# EAGLE design botstep23-5axis-carrier (EAGLE 5.11)
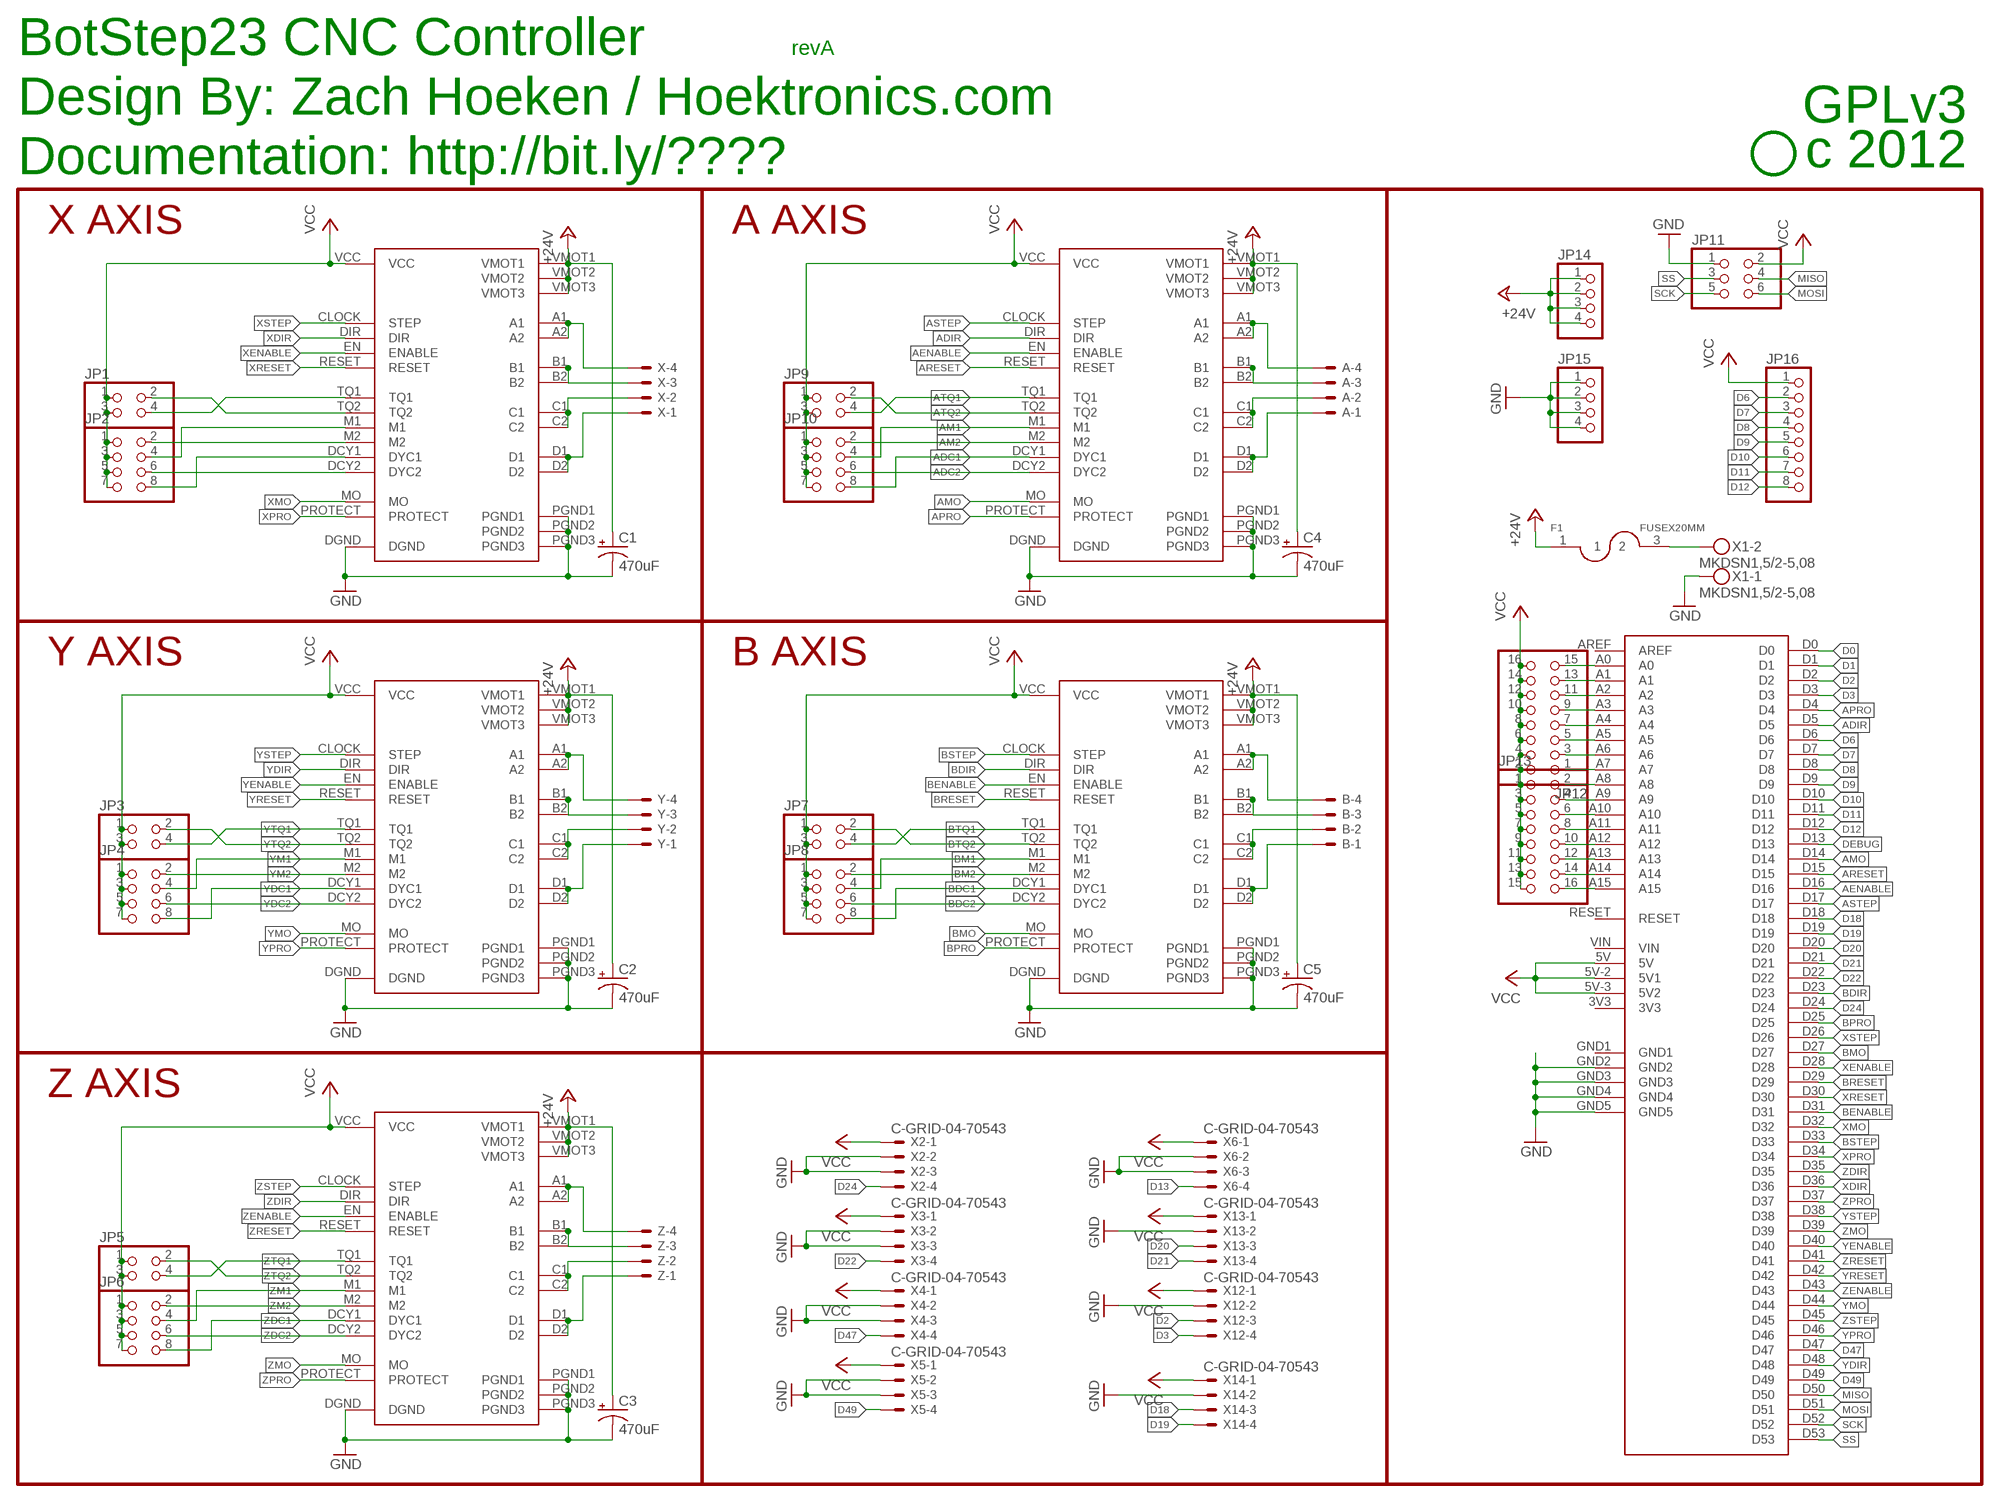
[diagram p0: schematic, sheet 1]

## Parts
A  KK-156-4  [KK-156-4]
B  KK-156-4  [KK-156-4]
C1  470uF  CPOL-USE3.5-8  [E3,5-8]
C2  470uF  CPOL-USE3.5-8  [E3,5-8]
C3  470uF  CPOL-USE3.5-8  [E3,5-8]
C4  470uF  CPOL-USE3.5-8  [E3,5-8]
C5  470uF  CPOL-USE3.5-8  [E3,5-8]
F1  FUSEX20MM  [FUSE_5MM]
JP1  PINHD-2X2  [2X02]
JP2  PINHD-2X4  [2X04]
JP3  PINHD-2X2  [2X02]
JP4  PINHD-2X4  [2X04]
JP5  PINHD-2X2  [2X02]
JP6  PINHD-2X4  [2X04]
JP7  PINHD-2X2  [2X02]
JP8  PINHD-2X4  [2X04]
JP9  PINHD-2X2  [2X02]
JP10  PINHD-2X4  [2X04]
JP11  PINHD-2X3  [2X03]
JP12  PINHD-2X8  [2X08]
JP13  PINHD-2X8  [2X08]
JP14  PINHD-1X4  [1X04]
JP15  PINHD-1X4  [1X04]
JP16  PINHD-1X8  [1X08]
U$1  BOTSTEP23  [BOTSTEP23]
U$2  BOTSTEP23  [BOTSTEP23]
U$3  BOTSTEP23  [BOTSTEP23]
U$4  BOTSTEP23  [BOTSTEP23]
U$5  BOTSTEP23  [BOTSTEP23]
U$6  ARDUINO-MEGA  [ARDUINO-MEGA]
X  KK-156-4  [KK-156-4]
X1  MKDSN1,5/2-5,08  [MKDSN1,5/2-5,08]
X2  C-GRID-04-70543  [70543-04]
X3  C-GRID-04-70543  [70543-04]
X4  C-GRID-04-70543  [70543-04]
X5  C-GRID-04-70543  [70543-04]
X6  C-GRID-04-70543  [70543-04]
X12  C-GRID-04-70543  [70543-04]
X13  C-GRID-04-70543  [70543-04]
X14  C-GRID-04-70543  [70543-04]
Y  KK-156-4  [KK-156-4]
Z  KK-156-4  [KK-156-4]

## Nets
+24V [power]: C1.+ C2.+ C3.+ C4.+ C5.+ F1.1 JP14.1 JP14.2 JP14.3 JP14.4 U$1.VMOT1 U$1.VMOT2 U$1.VMOT3 U$2.VMOT1 U$2.VMOT2 U$2.VMOT3 U$3.VMOT1 U$3.VMOT2 U$3.VMOT3 U$4.VMOT1 U$4.VMOT2 U$4.VMOT3 U$5.VMOT1 U$5.VMOT2 U$5.VMOT3
ADC1 [power]: JP10.8 U$4.DCY1(DYC1)
ADC2 [power]: JP10.6 U$4.DCY2(DYC2)
ADIR: U$4.DIR U$6.D5
AENABLE: U$4.EN(ENABLE) U$6.D16
AM1 [power]: JP10.4 U$4.M1
AM2 [power]: JP10.2 U$4.M2
AMO: U$4.MO U$6.D14
APRO: U$4.PROTECT U$6.D4
ARESET: U$4.RESET U$6.D15
ASTEP: U$4.CLOCK(STEP) U$6.D17
ATQ1 [power]: JP9.4 U$4.TQ1
ATQ2 [power]: JP9.2 U$4.TQ2
BDC1 [power]: JP8.8 U$5.DCY1(DYC1)
BDC2 [power]: JP8.6 U$5.DCY2(DYC2)
BDIR: U$5.DIR U$6.D23
BENABLE: U$5.EN(ENABLE) U$6.D31
BM1 [power]: JP8.4 U$5.M1
BM2 [power]: JP8.2 U$5.M2
BMO: U$5.MO U$6.D27
BPRO: U$5.PROTECT U$6.D25
BRESET: U$5.RESET U$6.D29
BSTEP: U$5.CLOCK(STEP) U$6.D33
BTQ1 [power]: JP7.4 U$5.TQ1
BTQ2 [power]: JP7.2 U$5.TQ2
D0: U$6.D0
D1: U$6.D1
D2: U$6.D2 X12.3
D3: U$6.D3 X12.4
D6: JP16.2 U$6.D6
D7: JP16.3 U$6.D7
D8: JP16.4 U$6.D8
D9: JP16.5 U$6.D9
D10: JP16.6 U$6.D10
D11: JP16.7 U$6.D11
D12: JP16.8 U$6.D12
D13: X6.4
D18: U$6.D18 X14.3
D19: U$6.D19 X14.4
D20: U$6.D20 X13.3
D21: U$6.D21 X13.4
D22: U$6.D22 X3.4
D24: U$6.D24 X2.4
D47: U$6.D47 X4.4
D49: U$6.D49 X5.4
DEBUG: U$6.D13
GND: C1.- C2.- C3.- C4.- C5.- JP11.1 JP15.1 JP15.2 JP15.3 JP15.4 U$1.DGND U$1.PGND1 U$1.PGND2 U$1.PGND3 U$2.DGND U$2.PGND1 U$2.PGND2 U$2.PGND3 U$3.DGND U$3.PGND1 U$3.PGND2 U$3.PGND3 U$4.DGND U$4.PGND1 U$4.PGND2 U$4.PGND3 U$5.DGND U$5.PGND1 U$5.PGND2 U$5.PGND3 U$6.GND2 U$6.GND3 U$6.GND4 U$6.GND5 X1.1 X2.2 X2.3 X3.2 X3.3 X4.2 X4.3 X5.2 X5.3 X6.2 X6.3 X12.2 X13.2 X14.2
MISO: JP11.4 U$6.D50
MOSI: JP11.6 U$6.D51
N$1 [power]: U$2.C1 U$2.C2 Y.2
N$2 [power]: U$1.C1 U$1.C2 X.2
N$3 [power]: U$1.B1 U$1.B2 X.3
N$4 [power]: U$1.A1 U$1.A2 X.4
N$5 [power]: U$1.D1 U$1.D2 X.1
N$6: F1.3 X1.2
N$7: JP12.15 U$6.A0
N$8: JP12.13 U$6.A1
N$9 [power]: U$2.B1 U$2.B2 Y.3
N$10 [power]: U$2.A1 U$2.A2 Y.4
N$11 [power]: U$2.D1 U$2.D2 Y.1
N$12: JP12.11 U$6.A2
N$13: JP12.9 U$6.A3
N$14: JP12.7 U$6.A4
N$15: JP12.5 U$6.A5
N$16: JP12.3 U$6.A6
N$17: JP12.1 U$6.A7
N$18: JP13.2 U$6.A8
N$19: JP13.4 U$6.A9
N$20: JP13.6 U$6.A10
N$21 [power]: U$3.C1 U$3.C2 Z.2
N$22 [power]: U$3.B1 U$3.B2 Z.3
N$23 [power]: U$3.A1 U$3.A2 Z.4
N$24 [power]: U$3.D1 U$3.D2 Z.1
N$25: JP13.8 U$6.A11
N$26: JP13.10 U$6.A12
N$27: JP13.12 U$6.A13
N$28: JP13.14 U$6.A14
N$29: JP13.16 U$6.A15
N$31 [power]: A.2 U$4.C1 U$4.C2
N$32 [power]: A.3 U$4.B1 U$4.B2
N$33 [power]: A.4 U$4.A1 U$4.A2
N$34 [power]: A.1 U$4.D1 U$4.D2
N$41 [power]: B.2 U$5.C1 U$5.C2
N$42 [power]: B.3 U$5.B1 U$5.B2
N$43 [power]: B.4 U$5.A1 U$5.A2
N$44 [power]: B.1 U$5.D1 U$5.D2
SCK: JP11.5 U$6.D52
SS: JP11.3 U$6.D53
VCC: JP1.1 JP1.3 JP2.1 JP2.3 JP2.5 JP2.7 JP3.1 JP3.3 JP4.1 JP4.3 JP4.5 JP4.7 JP5.1 JP5.3 JP6.1 JP6.3 JP6.5 JP6.7 JP7.1 JP7.3 JP8.1 JP8.3 JP8.5 JP8.7 JP9.1 JP9.3 JP10.1 JP10.3 JP10.5 JP10.7 JP11.2 JP12.2 JP12.4 JP12.6 JP12.8 JP12.10 JP12.12 JP12.14 JP12.16 JP13.1 JP13.3 JP13.5 JP13.7 JP13.9 JP13.11 JP13.13 JP13.15 JP16.1 U$1.VCC U$2.VCC U$3.VCC U$4.VCC U$5.VCC U$6.5V U$6.5V-2(5V1) U$6.5V-3(5V2) X2.1 X3.1 X4.1 X5.1 X6.1 X12.1 X13.1 X14.1
XDC1 [power]: JP2.8 U$1.DCY1(DYC1)
XDC2 [power]: JP2.6 U$1.DCY2(DYC2)
XDIR: U$1.DIR U$6.D36
XENABLE: U$1.EN(ENABLE) U$6.D28
XM1 [power]: JP2.4 U$1.M1
XM2 [power]: JP2.2 U$1.M2
XMO: U$1.MO U$6.D32
XPRO: U$1.PROTECT U$6.D34
XRESET: U$1.RESET U$6.D30
XSTEP: U$1.CLOCK(STEP) U$6.D26
XTQ1 [power]: JP1.4 U$1.TQ1
XTQ2 [power]: JP1.2 U$1.TQ2
YDC1 [power]: JP4.8 U$2.DCY1(DYC1)
YDC2 [power]: JP4.6 U$2.DCY2(DYC2)
YDIR: U$2.DIR U$6.D48
YENABLE: U$2.EN(ENABLE) U$6.D40
YM1 [power]: JP4.4 U$2.M1
YM2 [power]: JP4.2 U$2.M2
YMO: U$2.MO U$6.D44
YPRO: U$2.PROTECT U$6.D46
YRESET: U$2.RESET U$6.D42
YSTEP: U$2.CLOCK(STEP) U$6.D38
YTQ1 [power]: JP3.4 U$2.TQ1
YTQ2 [power]: JP3.2 U$2.TQ2
ZDC1 [power]: JP6.8 U$3.DCY1(DYC1)
ZDC2 [power]: JP6.6 U$3.DCY2(DYC2)
ZDIR: U$3.DIR U$6.D35
ZENABLE: U$3.EN(ENABLE) U$6.D43
ZM1 [power]: JP6.4 U$3.M1
ZM2 [power]: JP6.2 U$3.M2
ZMO: U$3.MO U$6.D39
ZPRO: U$3.PROTECT U$6.D37
ZRESET: U$3.RESET U$6.D41
ZSTEP: U$3.CLOCK(STEP) U$6.D45
ZTQ1 [power]: JP5.4 U$3.TQ1
ZTQ2 [power]: JP5.2 U$3.TQ2
Unconnected: U$6.3V3 U$6.AREF U$6.GND1 U$6.RESET U$6.VIN

## Notes on the sheet
- BotStep23 CNC Controller | revA
- GPLv3
- Design By: Zach Hoeken / Hoektronics.com | c 2012
- Documentation: http://bit.ly/????
- X AXIS | A AXIS
- Y AXIS | B AXIS
- Z AXIS

## Library data of the parts
A B X Y Z = con-molex:KK-156-4: KK 156 HEADER Source: http://www.molex.com/pdm_docs/sd/026604100_sd.pdf
C1-C5 = rcl:CPOL-US: POLARIZED CAPACITOR, American symbol
F1 = SparkFun:FUSE
JP1 JP3 JP5 JP7 JP9 = pinhead:PINHD-2X2: PIN HEADER
JP2 JP4 JP6 JP8 JP10 = pinhead:PINHD-2X4: PIN HEADER
JP11 = pinhead:PINHD-2X3: PIN HEADER
JP12 JP13 = pinhead:PINHD-2X8: PIN HEADER
JP14 JP15 = pinhead:PINHD-1X4: PIN HEADER
JP16 = pinhead:PINHD-1X8: PIN HEADER
U$1-U$5 = Hoeken:BOTSTEP23
U$6 = MakerBot:ARDUINO-MEGA
X1 = con-phoenix-508:MKDSN1,5/2-5,08: MKDSN 1,5/ 2-5,08 Printklemme Nennstrom: 13,5 A Nennspannung: 250 V Rastermaß: 5,08 mm Polzahl: 2 Anschlussart: Schraubanschluss Montage: Löten Anschlussrichtung Leiter/Platine: 0 ° Artikelnummer: 1729128 Source: http://eshop.phoenixcontact.com .. 1729128.pdf
X2-X6 X12-X14 = con-molex:C-GRID-04: CONNECTOR wire to board 2.54 mm (0.100") pitch header

## Net classes
0 default: width 0.406 mm, clearance 0.381 mm
1 power: width 1.27 mm, clearance 0.635 mm

## Board
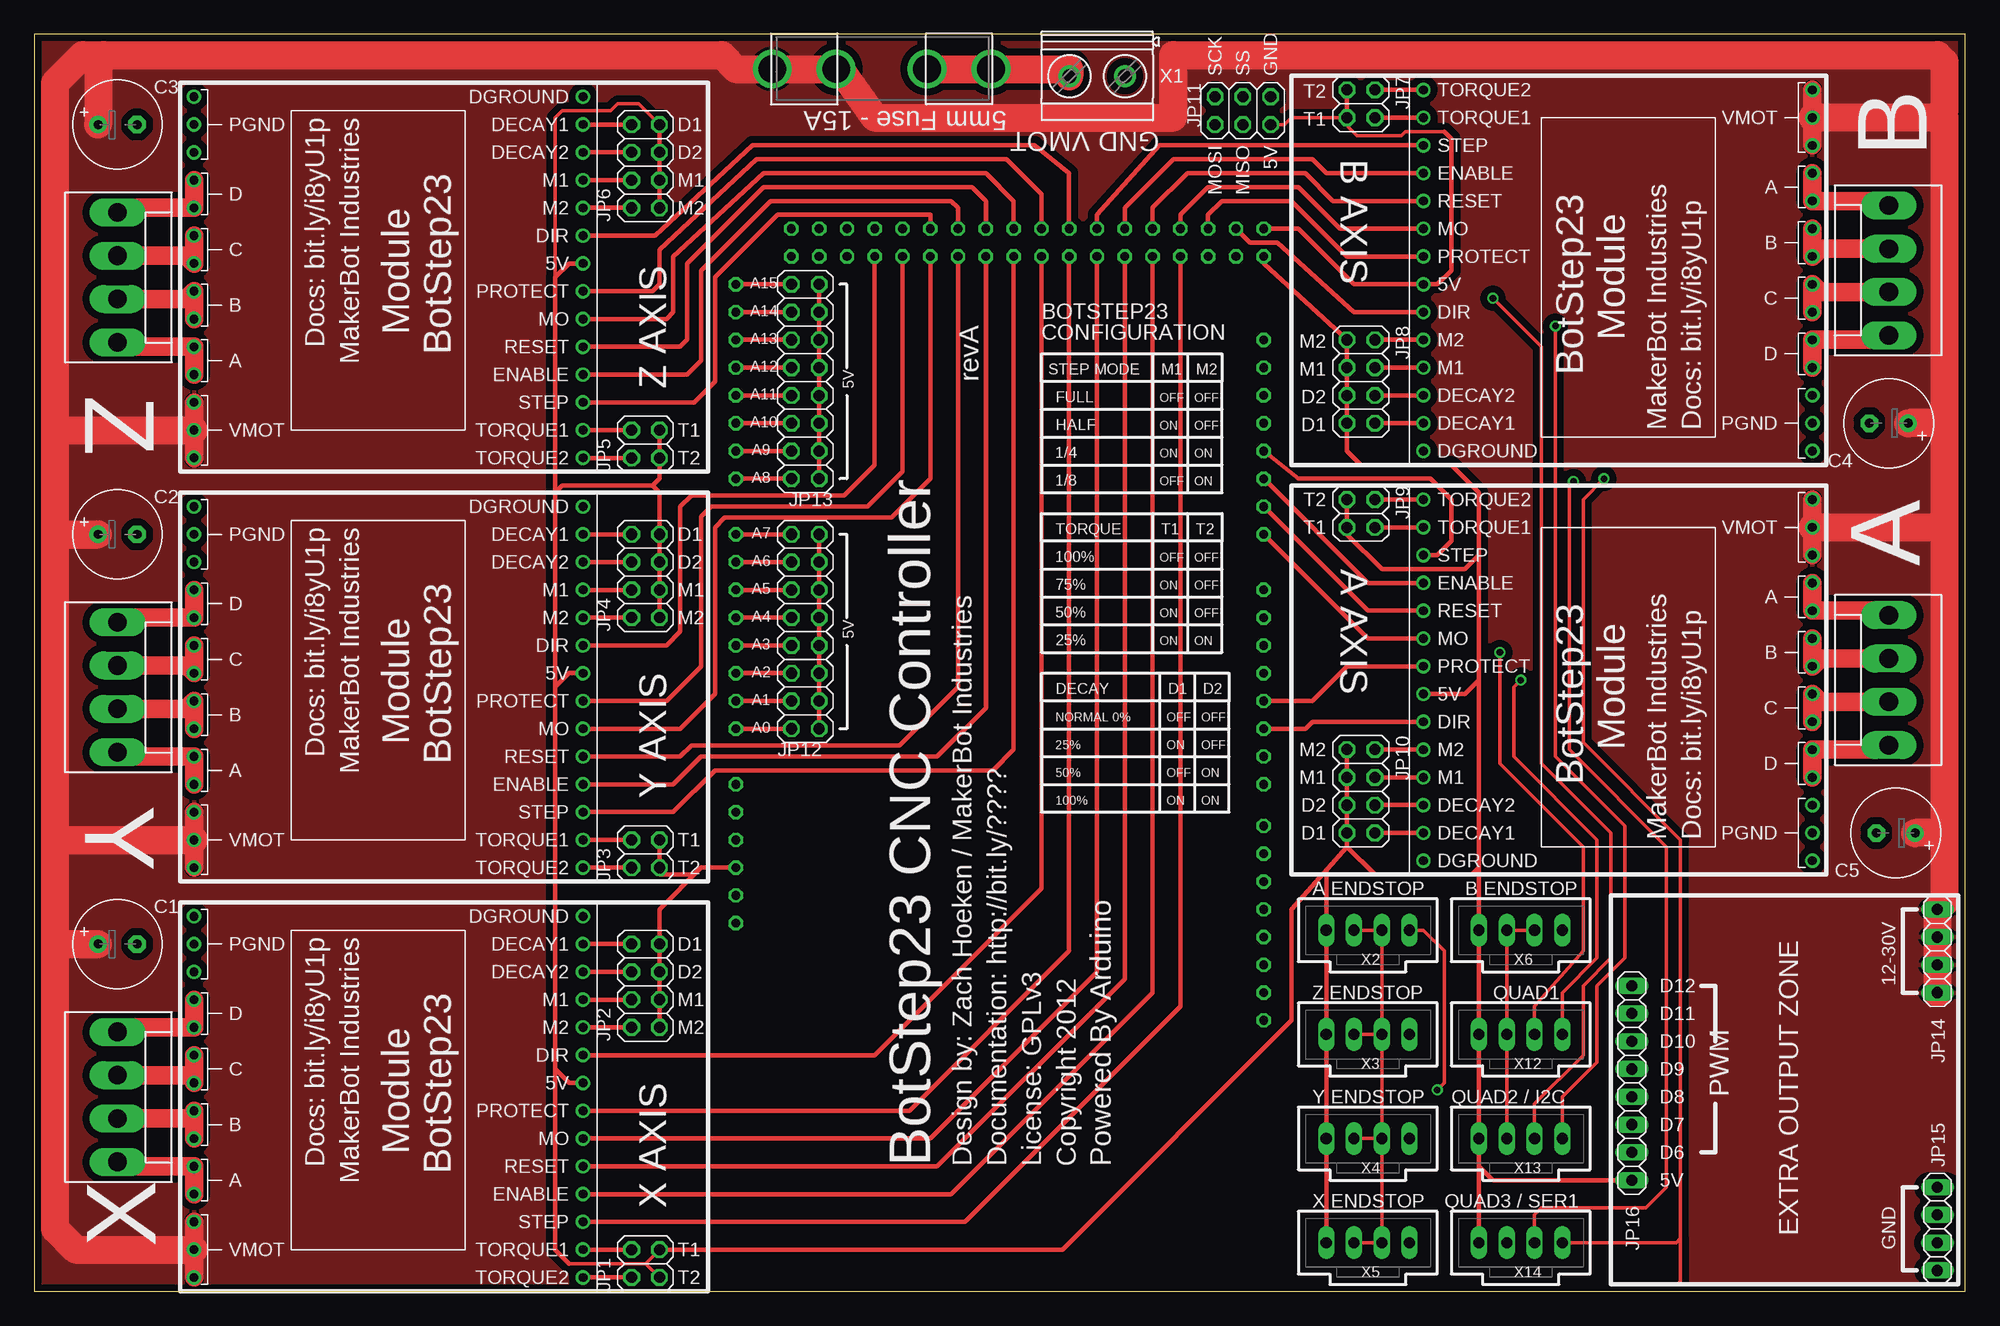
[diagram p1: board, top side]
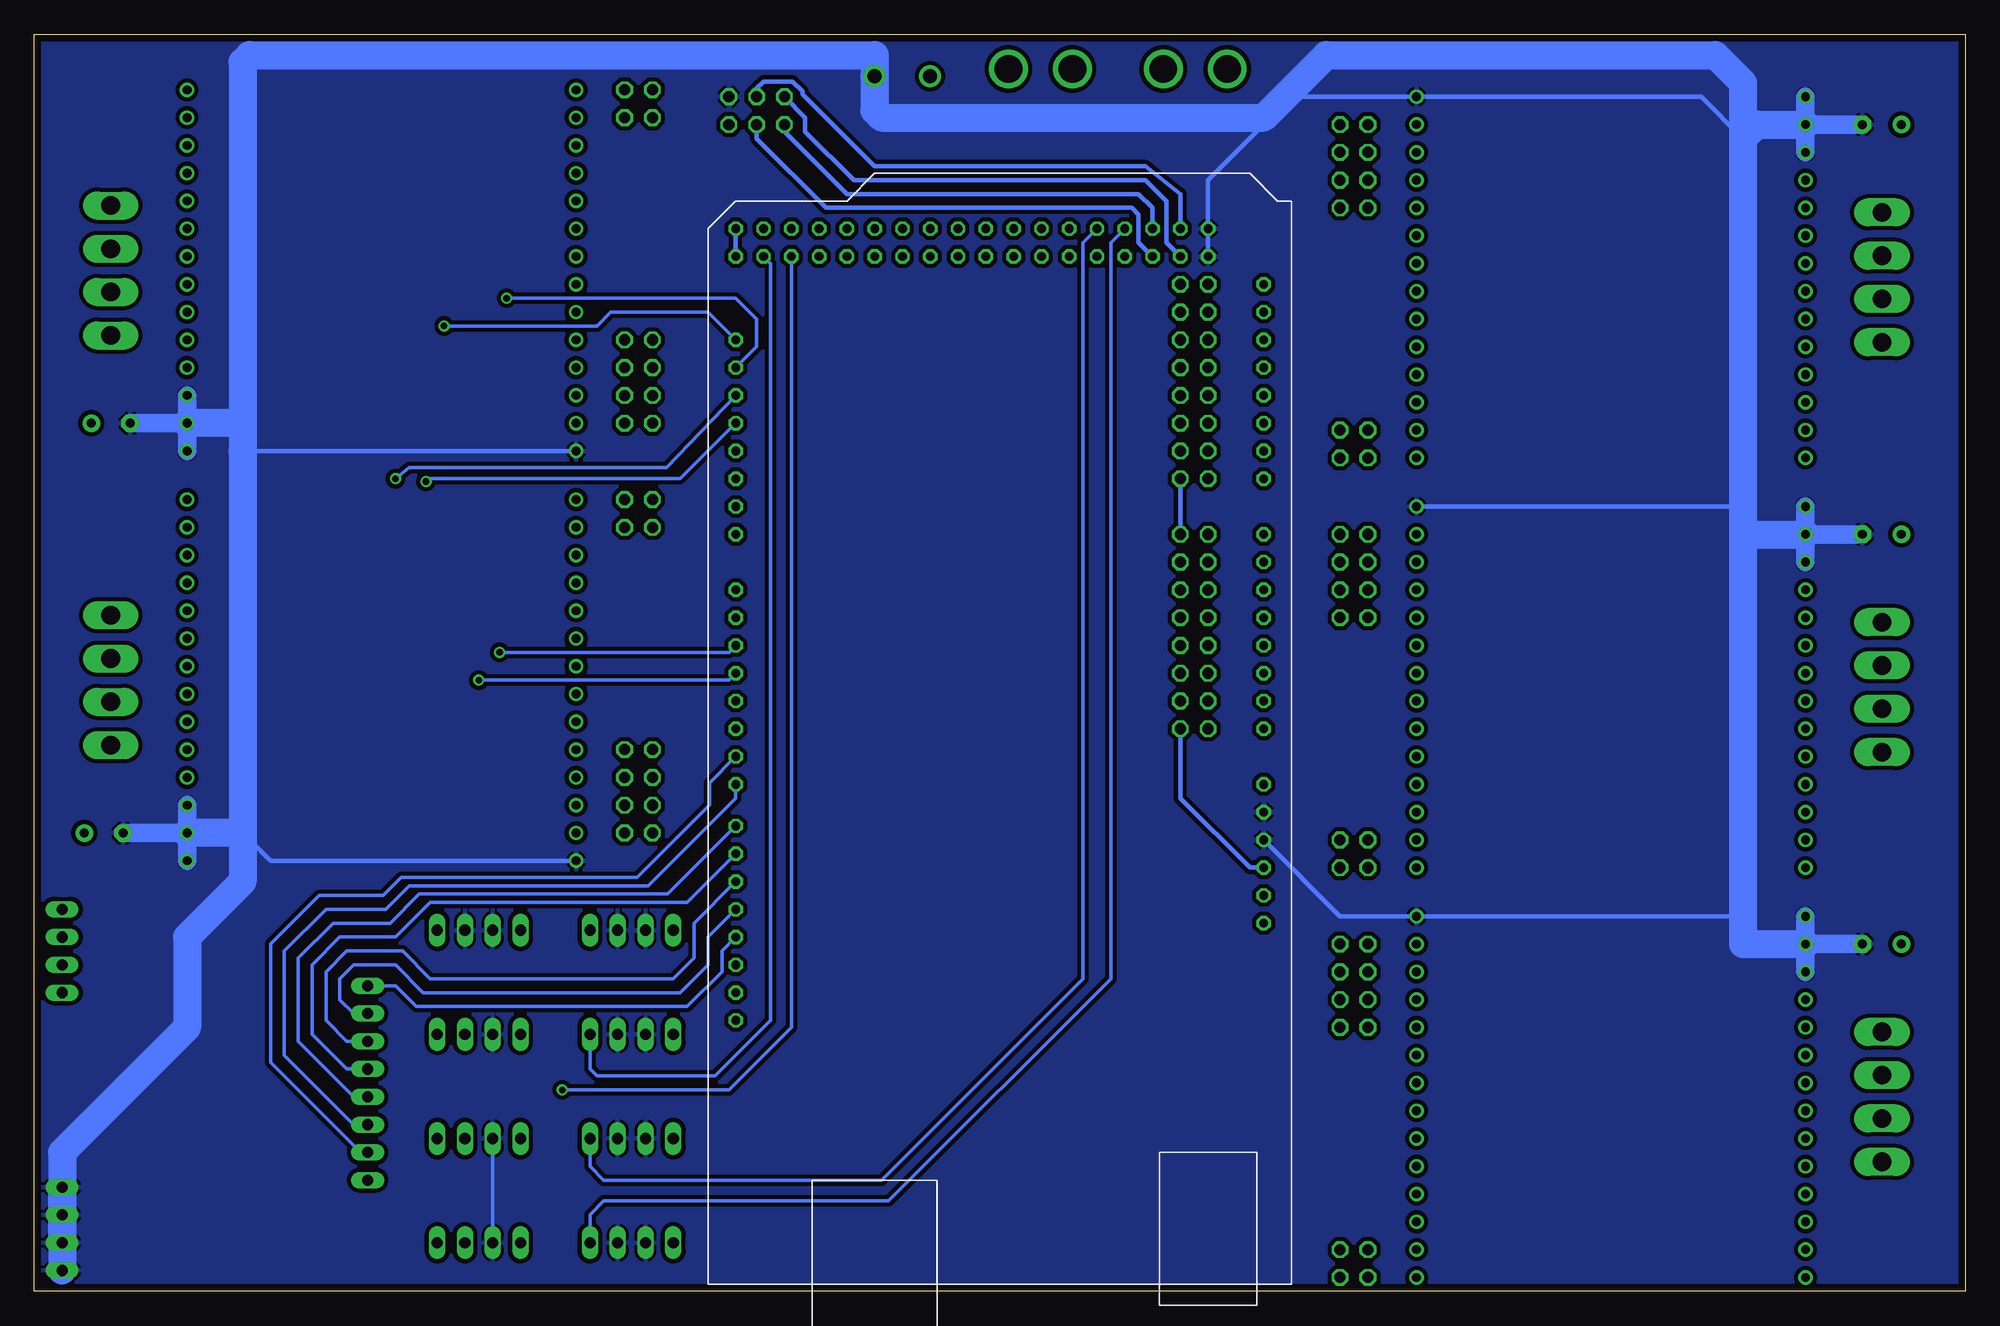
[diagram p2: board, bottom side, seen from below]

Size 176.53 x 114.94 mm. Coordinates in mm from the lower left corner, seen from the top.
Outline: 176.53,0 176.53,114.94 0,114.94 0,0 176.53,0
Copper layers (1*16): Top 0.035mm / dielectric 1.5mm / Bottom 0.035mm
Design rules "default *": minimum track width 10mil, minimum drill 24mil, track to track 15mil, track to pad 15mil, pad to pad 15mil, via to via 15mil, smd to smd 15mil, copper to edge 25mil, drill to drill 15mil, minimum pad ring 10mil, minimum via ring 8mil, stop-mask expansion 4mil, vias tented up to drill 0mil, thermal gap 10mil

### Footprints (pad centres in the part's own frame; a part is rotated, then mirrored left to right if it is on the bottom)
KK-156-4 = drill 1.7 pad 2.184 long: 1 -5.94,0; 2 -1.98,0; 3 1.98,0; 4 5.94,0
E3,5-8 = drill 0.813 pad 1.6 round: + -1.778,0 | drill 0.813 pad 1.6 octagon: - 1.778,0
FUSE_5MM = drill 2.54 pad 3.556 round: 1 0,-10; 2 0,-4.158; 3 0,4.158; 4 0,10
2X02 = drill 1.016 octagon: 1 -1.27,-1.27; 2 -1.27,1.27; 3 1.27,-1.27; 4 1.27,1.27
2X04 = drill 1.016 octagon: 1 -3.81,-1.27; 2 -3.81,1.27; 3 -1.27,-1.27; 4 -1.27,1.27; 5 1.27,-1.27; 6 1.27,1.27; 7 3.81,-1.27; 8 3.81,1.27
2X03 = drill 1.016 octagon: 1 -2.54,-1.27; 2 -2.54,1.27; 3 0,-1.27; 4 0,1.27; 5 2.54,-1.27; 6 2.54,1.27
2X08 = drill 1.016 octagon: 1 -8.89,-1.27; 2 -8.89,1.27; 3 -6.35,-1.27; 4 -6.35,1.27; 5 -3.81,-1.27; 6 -3.81,1.27; 7 -1.27,-1.27; 8 -1.27,1.27; 9 1.27,-1.27; 10 1.27,1.27; 11 3.81,-1.27; 12 3.81,1.27; 13 6.35,-1.27; 14 6.35,1.27; 15 8.89,-1.27; 16 8.89,1.27
1X04 = drill 1.016 long: 1 -3.81,0; 2 -1.27,0; 3 1.27,0; 4 3.81,0
1X08 = drill 1.016 long: 1 -8.89,0; 2 -6.35,0; 3 -3.81,0; 4 -1.27,0; 5 1.27,0; 6 3.81,0; 7 6.35,0; 8 8.89,0
BOTSTEP23 = drill 0.8 round: A1 17.78,7.62; A2 17.78,5.08; B1 17.78,2.54; B2 17.78,0; C1 17.78,-2.54; C2 17.78,-5.08; CLOCK -17.78,10.16; D1 17.78,-7.62; D2 17.78,-10.16; DCY1 -17.78,-15.24; DCY2 -17.78,-12.7; DGND -17.78,-17.78; DIR -17.78,-5.08; EN -17.78,7.62; M1 -17.78,-10.16; M2 -17.78,-7.62; MO -17.78,2.54; PGND1 17.78,-12.7; PGND2 17.78,-15.24; PGND3 17.78,-17.78; PROTECT -17.78,0; RESET -17.78,5.08; TQ1 -17.78,12.7; TQ2 -17.78,15.24; VCC -17.78,-2.54; VMOT1 17.78,15.24; VMOT2 17.78,12.7; VMOT3 17.78,10.16
ARDUINO-MEGA = drill 0.8 octagon: 3V3 35.56,2.54; 5V 93.98,50.8; 5V-2 96.52,50.8; 5V-3 38.1,2.54; A0 50.8,2.54; A1 53.34,2.54; A2 55.88,2.54; A3 58.42,2.54; A4 60.96,2.54; A5 63.5,2.54; A6 66.04,2.54; A7 68.58,2.54; A8 73.66,2.54; A9 76.2,2.54; A10 78.74,2.54; A11 81.28,2.54; A12 83.82,2.54; A13 86.36,2.54; A14 88.9,2.54; A15 91.44,2.54; AREF 24.13,50.8; D0 63.5,50.8; D1 60.96,50.8; D2 58.42,50.8; D3 55.88,50.8; D4 53.34,50.8; D5 50.8,50.8; D6 48.26,50.8; D7 45.72,50.8; D8 41.91,50.8; D9 39.37,50.8; D10 36.83,50.8; D11 34.29,50.8; D12 31.75,50.8; D13 29.21,50.8; D14 68.58,50.8; D15 71.12,50.8; D16 73.66,50.8; D17 76.2,50.8; D18 78.74,50.8; D19 81.28,50.8; D20 83.82,50.8; D21 86.36,50.8; D22 93.98,48.26; D23 96.52,48.26; D24 93.98,45.72; D25 96.52,45.72; D26 93.98,43.18; D27 96.52,43.18; D28 93.98,40.64; D29 96.52,40.64; D30 93.98,38.1; D31 96.52,38.1; D32 93.98,35.56; D33 96.52,35.56; D34 93.98,33.02; D35 96.52,33.02; D36 93.98,30.48; D37 96.52,30.48; D38 93.98,27.94; D39 96.52,27.94; D40 93.98,25.4; D41 96.52,25.4; D42 93.98,22.86; D43 96.52,22.86; D44 93.98,20.32; D45 96.52,20.32; D46 93.98,17.78; D47 96.52,17.78; D48 93.98,15.24; D49 96.52,15.24; D50 93.98,12.7; D51 96.52,12.7; D52 93.98,10.16; D53 96.52,10.16; GND1 26.67,50.8; GND2 93.98,7.62; GND3 96.52,7.62; GND4 40.64,2.54; GND5 43.18,2.54; RESET 33.02,2.54; VIN 45.72,2.54
MKDSN1,5/2-5,08 = drill 1.3 pad 2 round: 1 -2.561,0.025; 2 2.519,0.025
70543-04 = drill 1.016 long: 1 -3.81,0; 2 -1.27,0; 3 1.27,0; 4 3.81,0

### Placement (x,y rotation side)
A  169.54,55.88 90 top
B  169.54,93.34 90 top
C1  7.62,31.75 0 top
C2  7.62,69.22 0 top
C3  7.62,106.68 0 top
C4  169.54,79.38 180 top
C5  170.18,41.91 180 top
F1  77.47,111.76 270 top
JP1  55.88,2.54 90 top
JP2  55.88,27.94 90 top
JP3  55.88,40.01 90 top
JP4  55.88,65.41 90 top
JP5  55.88,77.47 90 top
JP6  55.88,102.87 90 top
JP7  121.28,108.58 270 top
JP8  121.28,83.19 270 top
JP9  121.28,71.12 270 top
JP10  121.28,45.72 270 top
JP11  110.49,107.95 180 top
JP12  70.48,60.33 270 top
JP13  70.48,83.19 90 top
JP14  173.99,31.11 90 top
JP15  173.99,5.71 90 top
JP16  146.05,19.05 90 top
U$1  32.38,16.51 180 top
U$2  32.38,53.98 180 top
U$3  32.38,91.44 180 top
U$4  144.78,57.15 0 top
U$5  144.78,94.61 0 top
U$6  61.59,0.64 90 bottom
X  7.62,17.78 270 top
X1  97.16,111.12 180 top
X2  121.92,33.02 0 top
X3  121.92,23.5 0 top
X4  121.92,13.97 0 top
X5  121.92,4.45 0 top
X6  135.89,33.02 0 top
X12  135.89,23.5 0 top
X13  135.89,13.97 0 top
X14  135.89,4.45 0 top
Y  7.62,55.24 270 top
Z  7.62,92.71 270 top

### Tracks (layer width: path | path; a pad name or v marks a point on that pad's centre or on a via)
+24V
  Top 1.676: U$2.VMOT3 U$2.VMOT2 U$2.VMOT1 | U$3.VMOT1 U$3.VMOT2 U$3.VMOT3 | U$5.VMOT1 U$5.VMOT2 U$5.VMOT3 | U$4.VMOT1 U$4.VMOT2 U$4.VMOT3 | U$1.VMOT3 U$1.VMOT2 U$1.VMOT1
  Top 2.54: 1.91,31.75 1.91,41.27 | 1.91,41.27 1.91,69.22 | 1.91,69.22 1.91,78.74 | 1.91,69.22 C2.+ | 1.91,31.75 C1.+ | 1.91,78.74 U$3.VMOT2 | 1.91,41.27 U$2.VMOT2 | 174.62,69.85 174.62,41.91 | 174.62,79.38 174.62,69.85 | 174.62,79.38 174.62,107.31 173.99,107.31 | 173.99,107.31 U$5.VMOT2 | 174.62,69.85 U$4.VMOT2 | 174.62,41.91 C5.+ | 174.62,79.38 C4.+ | 1.91,31.75 1.91,5.71 3.81,3.81 U$1.VMOT2 | 6.35,113.03 4.45,113.03 1.91,110.49 1.91,78.74 | C3.+ 5.84,112.52 6.35,113.03 | 173.99,107.31 174.62,107.95 174.62,112.39 173.99,113.03 104.14,113.03 104.14,107.31 76.83,107.31 73.66,111.76 F1.1 64.14,111.76 62.87,113.03 6.35,113.03 | 174.62,41.91 174.62,35.56 JP14.4 JP14.3 JP14.2 JP14.1
  pour Top: 0,114.94 176.53,114.94 176.53,0 0,0
ADC1
  Top 0.406: JP10.8 U$4.DCY1
ADC2
  Top 0.406: JP10.6 U$4.DCY2
ADIR
  Top 0.406: U$6.D5 116.2,51.44 116.84,52.07 U$4.DIR
AENABLE
  Top 0.406: U$4.EN 121.92,64.77 U$6.D16
AM1
  Top 0.406: JP10.4 U$4.M1
AM2
  Top 0.406: JP10.2 U$4.M2
AMO
  Top 0.406: U$4.MO 121.92,59.69 U$6.D14
APRO
  Top 0.406: U$4.PROTECT 120.02,57.15 116.84,53.98 U$6.D4
ARESET
  Top 0.406: U$4.RESET 121.92,62.23 U$6.D15
ASTEP
  Top 0.406: U$4.CLOCK 128.27,67.31 129.54,68.58 129.54,72.39 127.64,74.3 115.57,74.3 U$6.D17
ATQ1
  Top 0.406: JP9.4 U$4.TQ1
ATQ2
  Top 0.406: JP9.2 U$4.TQ2
BDC1
  Top 0.406: JP8.8 U$5.DCY1
BDC2
  Top 0.406: JP8.6 U$5.DCY2
BDIR
  Top 0.406: U$6.D23 111.12,95.89 113.67,95.89 120.65,89.53 U$5.DIR
BENABLE
  Top 0.406: U$5.EN 118.11,102.23 116.84,103.5 104.14,103.5 99.69,99.06 U$6.D31
BM1
  Top 0.406: JP8.4 U$5.M1
BM2
  Top 0.406: JP8.2 U$5.M2
BMO
  Top 0.406: U$5.MO 119.38,97.16 115.57,100.97 107.31,100.97 104.78,98.42 U$6.D27
BPRO
  Top 0.406: U$5.PROTECT 120.02,94.61 114.94,99.69 108.58,99.69 107.31,98.42 U$6.D25
BRESET
  Top 0.406: U$5.RESET 118.75,99.69 116.2,102.23 105.41,102.23 102.23,99.06 U$6.D29
BSTEP
  Top 0.406: U$5.CLOCK 102.87,104.78 97.16,98.42 U$6.D33
BTQ1
  Top 0.406: JP7.4 U$5.TQ1
BTQ2
  Top 0.406: JP7.2 U$5.TQ2
D2  (via drill 0.6)
  Top 0.305: v133.99,58.42 133.99,48.26 141.6,40.64 141.6,31.11 137.16,26.04 X12.3
  Bottom 0.305: U$6.D2 113.03,58.42 v133.99,58.42
D3  (via drill 0.6)
  Top 0.305: X12.4 139.7,27.3 142.88,30.48 142.88,41.27 135.25,48.9 135.25,55.24 v135.89,55.88
  Bottom 0.305: v135.89,55.88 113.03,55.88 U$6.D3
D6
  Bottom 0.305: JP16.2 146.69,12.7 154.94,20.95 154.94,31.75 150.5,36.2 144.65,36.2 143,37.85 121.41,37.85 114.81,44.45 114.81,46.48 U$6.D6
D7
  Bottom 0.305: JP16.3 147.32,15.24 153.67,21.59 153.67,31.11 149.86,34.92 144.4,34.92 142.24,37.08 120.4,37.08 112.39,45.09 U$6.D7
D8
  Bottom 0.305: JP16.4 147.32,17.78 152.4,22.86 152.4,30.48 149.22,33.66 144.02,33.66 141.35,36.32 118.62,36.32 U$6.D8
D9
  Bottom 0.305: JP16.5 147.96,20.32 151.13,23.5 151.13,29.84 148.59,32.38 143.51,32.38 140.34,35.56 116.84,35.56 U$6.D9
D10
  Bottom 0.305: JP16.6 147.96,22.86 149.86,24.77 149.86,29.21 147.96,31.11 142.88,31.11 140.34,28.57 118.11,28.57 116.2,30.48 116.2,33.66 U$6.D10
D11
  Bottom 0.305: JP16.7 147.32,25.4 148.59,26.67 148.59,28.57 147.32,29.84 143.51,29.84 140.97,27.3 117.47,27.3 114.94,29.84 114.94,32.38 U$6.D11
D12
  Bottom 0.305: JP16.8 143.51,27.94 141.6,26.04 116.84,26.04 113.67,29.21 113.67,31.11 U$6.D12
D18  (via drill 0.6)
  Top 0.305: X14.3 137.16,6.99 137.79,7.62 147.32,7.62 149.22,9.53 149.22,40.64 140.34,49.53 140.34,73.66 v140.72,74.04
  Bottom 0.305: U$6.D18 117.47,74.3 140.34,74.3 140.59,74.04 v140.72,74.04
D19  (via drill 0.6)
  Top 0.305: v143.51,74.3 141.6,72.39 141.6,50.16 150.5,41.27 150.5,4.83 | 150.5,4.83 150.5,0.89 150.37,0.76 | X14.4 150.11,4.45 150.5,4.83
  Bottom 0.305: v143.51,74.3 142.24,75.31 118.75,75.31 U$6.D19
D20  (via drill 0.6)
  Top 0.305: X13.3 137.16,17.14 141.6,21.59 141.6,27.94 144.15,30.48 144.15,41.91 137.79,48.26 137.79,86.36 v133.35,90.81
  Bottom 0.305: v133.35,90.81 112.39,90.81 110.49,88.9 110.49,86.36 U$6.D20
D21  (via drill 0.6)
  Top 0.305: X13.4 139.7,17.78 142.88,20.95 142.88,27.94 145.41,30.48 145.41,42.55 139.06,48.9 v139.06,88.27
  Bottom 0.305: v139.06,88.27 125.09,88.27 123.83,89.53 114.94,89.53 U$6.D21
D22
  Bottom 0.305: X3.4 125.73,20.32 125.09,19.68 114.3,19.68 109.22,24.77 109.22,93.98 U$6.D22
D24  (via drill 0.6)
  Top 0.305: X2.4 127,33.02 128.91,31.11 128.91,19.05 v128.27,18.41
  Bottom 0.305: v128.27,18.41 113.03,18.41 107.31,24.13 U$6.D24
D47
  Bottom 0.305: X4.4 125.73,11.43 124.46,10.16 99.06,10.16 80.64,28.57 80.64,95.89 U$6.D47
D49
  Bottom 0.305: X5.4 125.73,6.99 124.46,8.26 98.42,8.26 78.11,28.57 78.11,95.89 U$6.D49
GND
  Top 0.305: X13.2 X12.2 X6.2 X6.3 | X4.3 X5.3 X5.2 | X4.3 X3.3 | X3.3 X3.2 | X4.3 X4.2 | X3.3 X2.3 X2.2
  Bottom 0.305: X14.2 X13.2
  Bottom 0.406: 20.32,71.75 U$2.DGND | 20.32,105.41 24.13,109.22 U$3.DGND 61.59,109.22 69.22,101.6 U$6.GND3 U$6.GND2 | 20.32,34.29 U$1.DGND 57.15,34.29 U$6.GND4 | 157.48,76.83 U$5.DGND | U$4.DGND 154.94,39.37 157.48,41.91
  Bottom 1.676: U$1.PGND2 U$1.PGND1 | U$1.PGND2 C1.- | U$2.PGND2 C2.- | U$2.PGND2 U$2.PGND3 | U$3.PGND2 C3.- | U$3.PGND2 U$3.PGND3 | U$3.PGND2 U$3.PGND1 | C4.- U$5.PGND2 U$5.PGND1 | U$1.PGND2 U$1.PGND3 | U$2.PGND2 U$2.PGND1 | U$4.PGND2 U$4.PGND1 | U$4.PGND2 U$4.PGND3 | U$4.PGND2 C5.- | U$5.PGND3 162.56,78.74 161.93,79.38
  Bottom 2.54: 20.32,69.22 20.32,34.29 20.32,31.75 U$1.PGND2 | 20.32,69.22 20.32,71.75 20.32,105.41 | 20.32,105.41 19.05,106.68 U$3.PGND2 | 20.32,69.22 U$2.PGND2 | 157.48,79.38 157.48,76.83 157.48,41.91 | 157.48,41.91 U$4.PGND2 | 157.48,79.38 161.93,79.38 U$5.PGND2 | 157.48,79.38 157.48,112.39 156.84,113.03 99.69,113.03 99.69,111.12 99.72,111.12 X1.1 99.72,107.97 99.06,107.31 64.14,107.31 58.42,113.03 22.86,113.03 20.32,110.49 20.32,105.41 | JP15.2 JP15.1 | JP15.2 JP15.3 JP15.4 | JP15.2 173.99,12.7 162.56,24.13 162.56,32.38 157.48,37.47 157.48,41.91
  pour Bottom: 0,114.94 176.53,114.94 176.53,0 0,0
MISO
  Bottom 0.406: U$6.D50 75.56,95.89 75.56,98.42 76.2,99.06 104.14,99.06 110.49,105.41 JP11.4
MOSI
  Bottom 0.406: U$6.D51 74.3,99.06 75.56,100.33 102.23,100.33 107.95,106.05 JP11.6
N$1
  Top 1.676: U$2.C2 U$2.C1 13.89,57.23 Y.2
N$2
  Top 1.676: 14.61,19.68 U$1.C1 | 14.61,19.68 U$1.C2 | X.2 14.53,19.76 14.61,19.68
N$3
  Top 1.676: 14.61,15.88 U$1.B1 | 14.61,15.88 U$1.B2 | X.3 14.53,15.8 14.61,15.88
N$4
  Top 1.676: U$1.A1 U$1.A2 8.03,11.43 X.4
N$5
  Top 1.676: U$1.D2 U$1.D1 8.03,24.13 X.1
N$6
  Top 2.54: X1.2 94.64,111.74 94.61,111.76 F1.3
N$7
  Top 0.406: U$6.A0 JP12.15
N$8
  Top 0.406: U$6.A1 JP12.13
N$9
  Top 1.676: U$2.B1 U$2.B2 13.89,53.27 Y.3
N$10
  Top 1.676: U$2.A1 U$2.A2 8.03,48.9 Y.4
N$11
  Top 1.676: U$2.D2 U$2.D1 8.03,61.59 Y.1
N$12
  Top 0.406: U$6.A2 JP12.11
N$13
  Top 0.406: U$6.A3 JP12.9
N$14
  Top 0.406: U$6.A4 JP12.7
N$15
  Top 0.406: U$6.A5 JP12.5
N$16
  Top 0.406: U$6.A6 JP12.3
N$17
  Top 0.406: U$6.A7 JP12.1
N$18
  Top 0.406: U$6.A8 JP13.2
N$19
  Top 0.406: U$6.A9 JP13.4
N$20
  Top 0.406: U$6.A10 JP13.6
N$21
  Top 1.676: U$3.C2 U$3.C1 13.89,94.69 Z.2
N$22
  Top 1.676: U$3.B1 U$3.B2 13.89,90.73 Z.3
N$23
  Top 1.676: U$3.A1 U$3.A2 8.03,86.36 Z.4
N$24
  Top 1.676: U$3.D2 U$3.D1 8.03,99.06 Z.1
N$25
  Top 0.406: U$6.A11 JP13.8
N$26
  Top 0.406: U$6.A12 JP13.10
N$27
  Top 0.406: U$6.A13 JP13.12
N$28
  Top 0.406: U$6.A14 JP13.14
N$29
  Top 0.406: U$6.A15 JP13.16
N$31
  Top 1.676: U$4.C2 U$4.C1 163.27,53.9 A.2
N$32
  Top 1.676: U$4.B1 U$4.B2 163.27,57.86 A.3
N$33
  Top 1.676: U$4.A1 U$4.A2 169.13,62.23 A.4
N$34
  Top 1.676: U$4.D2 U$4.D1 169.13,49.53 A.1
N$41
  Top 1.676: U$5.C2 U$5.C1 163.27,91.36 B.2
N$42
  Top 1.676: B.3 163.27,95.33 U$5.B2 U$5.B1
N$43
  Top 1.676: U$5.A1 U$5.A2 169.13,99.69 B.4
N$44
  Top 1.676: U$5.D2 U$5.D1 169.13,87 B.1
SCK
  Bottom 0.406: U$6.D52 73.03,95.89 73.03,99.69 74.93,101.6 101.6,101.6 106.05,106.05 106.05,107.31 JP11.5
SS
  Bottom 0.406: U$6.D53 71.75,100.33 74.93,102.87 99.69,102.87 106.3,109.47 106.3,109.73 107.19,110.62 109.86,110.62 110.49,109.98 JP11.3
VCC
  Top 0.305: 47.62,92.71 47.62,107.31 48.26,107.95 52.7,107.95 53.34,108.58 55.24,108.58 JP6.7 | 48.9,2.54 55.88,2.54 | 55.88,2.54 JP1.1 | 55.88,2.54 JP1.3 | JP11.2 114.3,106.68 114.94,107.31 JP7.3 120.14,107.19 120.14,106.43 120.9,105.66 124.97,105.66 125.35,106.05 128.91,106.05
  Top 0.406: JP6.1 JP6.3 JP6.5 JP6.7 | 47.62,20.32 47.62,3.81 48.9,2.54 | 47.62,20.32 47.62,35.56 | 47.62,35.56 47.62,55.24 | 47.62,55.24 47.62,73.03 | 47.62,73.03 47.62,92.71 48.9,93.98 U$3.VCC | U$1.VCC 48.9,19.05 47.62,20.32 | JP2.1 JP2.3 JP2.5 JP2.7 57.15,34.92 57.78,35.56 | JP3.3 JP3.1 57.15,38.1 60.33,38.1 | JP5.3 JP5.1 57.15,74.3 56.52,73.66 | JP4.1 JP4.3 JP4.5 JP4.7 57.15,73.03 56.52,73.66 | 56.52,73.66 48.26,73.66 47.62,73.03 | U$2.VCC 48.9,56.52 47.62,55.24 | U$6.5V-3 60.96,38.73 60.33,38.1 | 57.78,35.56 60.33,38.1 | 47.62,35.56 57.78,35.56 | U$6.5V 112.39,93.98 JP8.1 JP8.3 JP8.5 JP8.7 120.02,76.83 121.28,75.56 129.54,75.56 132.08,73.03 132.08,67.31 | U$6.5V-2 115.57,97.16 120.65,92.08 U$5.VCC 128.27,92.08 129.54,93.34 129.54,105.41 128.91,106.05 | 132.08,38.73 132.08,55.88 | 132.08,55.88 132.08,67.31 | 132.08,38.73 131.44,38.1 122.56,38.1 120.02,40.64 | 120.02,40.64 JP10.7 JP10.5 JP10.3 JP10.1 | U$4.VCC 130.81,54.61 132.08,55.88 | JP9.3 JP9.1 120.02,69.22 123.19,66.04 130.81,66.04 132.08,67.31 | JP7.3 JP7.1 | JP1.3 93.98,3.81 114.94,24.77 114.94,34.92 118.23,38.63 | 118.23,38.63 120.02,40.64 | JP13.15 JP13.13 JP13.11 JP13.9 JP13.7 JP13.5 JP13.3 JP13.1 | JP12.2 JP12.4 JP12.6 JP12.8 JP12.10 JP12.12 JP12.14 JP12.16 | 118.23,38.63 118.11,38.51 X2.1 X3.1 X4.1 X5.1 | 132.08,11.43 X13.1 X12.1 X6.1 132.08,38.73 | 132.08,11.43 X14.1 | JP16.1 133.35,10.16 132.08,11.43
  Bottom 0.406: U$6.5V U$6.5V-2 | JP12.2 JP13.1 | JP12.16 71.75,45.09 65.41,38.73 U$6.5V-3
XDC1
  Top 0.406: U$1.DCY1 JP2.8
XDC2
  Top 0.406: U$1.DCY2 JP2.6
XDIR
  Top 0.406: U$6.D36 92.08,36.83 76.83,21.59 U$1.DIR
XENABLE
  Top 0.406: U$6.D28 102.23,27.3 83.82,8.89 U$1.EN
XM1
  Top 0.406: U$1.M1 JP2.4
XM2
  Top 0.406: U$1.M2 JP2.2
XMO
  Top 0.406: U$1.MO 81.92,13.97 97.16,29.21 U$6.D32
XPRO
  Top 0.406: U$6.D34 94.61,31.11 80.01,16.51 U$1.PROTECT
XRESET
  Top 0.406: U$6.D30 99.69,28.57 82.55,11.43 U$1.RESET
XSTEP
  Top 0.406: U$6.D26 104.78,26.04 85.09,6.35 U$1.CLOCK
XTQ1
  Top 0.406: U$1.TQ1 JP1.4
XTQ2
  Top 0.406: U$1.TQ2 JP1.2
YDC1
  Top 0.406: U$2.DCY1 JP4.8
YDC2
  Top 0.406: U$2.DCY2 JP4.6
YDIR
  Top 0.406: U$6.D48 76.83,75.56 74.04,72.77 60.07,72.77 59.05,71.75 59.05,60.33 57.78,59.05 U$2.DIR
YENABLE
  Top 0.406: U$6.D40 87,53.34 82.55,48.9 60.96,48.9 58.42,46.35 U$2.EN
YM1
  Top 0.406: U$2.M1 JP4.4
YM2
  Top 0.406: U$2.M2 JP4.2
YMO
  Top 0.406: U$6.D44 81.92,74.3 78.36,70.74 63.12,70.74 62.23,69.85 62.23,54.61 59.05,51.44 U$2.MO
YPRO
  Top 0.406: U$2.PROTECT 57.78,53.98 60.96,57.15 60.96,70.86 61.86,71.75 76.2,71.75 79.38,74.93 U$6.D46
YRESET
  Top 0.406: U$6.D42 84.45,55.24 79.12,49.91 60.07,49.91 59.05,48.9 U$2.RESET
YSTEP
  Top 0.406: U$6.D38 89.53,49.53 87.63,47.62 62.23,47.62 58.42,43.81 U$2.CLOCK
YTQ1
  Top 0.406: U$2.TQ1 JP3.4
YTQ2
  Top 0.406: U$2.TQ2 JP3.2
ZDC1
  Top 0.406: U$3.DCY1 JP6.8
ZDC2
  Top 0.406: U$3.DCY2 JP6.6
ZDIR
  Top 0.406: U$3.DIR 56.77,96.52 65.66,104.78 91.44,104.78 94.61,102.23 U$6.D35
ZENABLE
  Top 0.406: U$3.EN 59.69,83.82 60.96,85.09 60.96,93.34 67.31,99.69 83.82,99.69 84.45,99.06 U$6.D43
ZM1
  Top 0.406: U$3.M1 JP6.4
ZM2
  Top 0.406: U$3.M2 JP6.2
ZMO
  Top 0.406: U$3.MO 57.78,88.9 58.42,89.53 58.42,94.61 66.67,102.23 87,102.23 89.53,99.69 U$6.D39
ZPRO
  Top 0.406: U$3.PROTECT 56.52,91.44 57.15,92.08 57.15,95.25 66.04,103.5 88.9,103.5 92.08,100.33 U$6.D37
ZRESET
  Top 0.406: U$3.RESET 59.05,86.36 59.69,87 59.69,93.98 66.67,100.97 85.72,100.97 87,99.69 U$6.D41
ZSTEP
  Top 0.406: U$6.D45 81.92,98.42 67.94,98.42 62.23,92.71 62.23,83.19 60.33,81.28 U$3.CLOCK
ZTQ1
  Top 0.406: U$3.TQ1 JP5.4
ZTQ2
  Top 0.406: U$3.TQ2 JP5.2

### Text on the board
tPlace: SCK | SS | GND | T2 | 5mm Fuse - 15A | T1 | D1 | VMOT | GND | MOSI | MISO | 5V | D2 | B AXIS | M1 | M2 | A15 | A14 | BOTSTEP23 | A13 | M2 | CONFIGURATION | A12 | M1 | STEP MODE | M1 | M2 | Z AXIS | A11 | 5V | revA | D2 | FULL | OFF | OFF | A10 | D1 | HALF | ON | OFF | T1 | A9 | T2 | 1/4 | ON | ON | A8 | 1/8 | OFF | ON | T2 | A7 | T1 | D1 | TORQUE | T1 | T2 | A6 | 100% | OFF | OFF | D2 | A AXIS | A5 | M1 | 75% | ON | OFF | A4 | 50% | ON | OFF | M2 | A3 | 5V | 25% | ON | ON | A2 | A1 | DECAY | D1 | D2 | A0 | NORMAL 0% | OFF | OFF | 25% | ON | OFF | M2 | M1 | 50% | OFF | ON | Y AXIS | D2 | 100% | ON | ON | D1 | T1 | T2 | A ENDSTOP | B ENDSTOP | D1 | D2 | 12-30V | Z ENDSTOP | QUAD1 | D12 | M1 | D11 | M2 | D10 | D9 | PWM | Y ENDSTOP | QUAD2 / I2C | D8 | D7 | D6 | BotStep23 CNC Controller | Design by: Zach Hoeken / MakerBot Industries | Documentation: http://bit.ly/???? | License: GPLv3 | Copyright 2012 | Powered By Arduino | 5V | X AXIS | X ENDSTOP | QUAD3 / SER1 | EXTRA OUTPUT ZONE | GND | T1 | T2